# Altium project ThietbiTN.PrjPCB
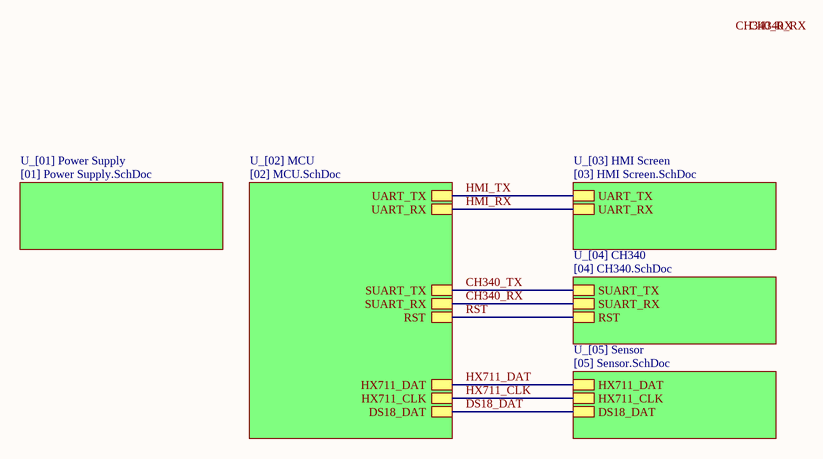
[diagram p0: ThietbiTN.SchDoc]
6 sheets, 60 parts. Net scope: hierarchical (ports join the sheet entries above them; power ports are global).
Board file: LoadCellV1_1.PcbDoc
Sheets:
  ThietbiTN.SchDoc
    U_[02] MCU = [02] MCU.SchDoc
    U_[01] Power Supply = [01] Power Supply.SchDoc
    U_[03] HMI Screen = [03] HMI Screen.SchDoc
    U_[04] CH340 = [04] CH340.SchDoc
    U_[05] Sensor = [05] Sensor.SchDoc

## Sheet ThietbiTN.SchDoc
size A4

### Sub-sheets
U_[01] Power Supply = [01] Power Supply.SchDoc: no entries
U_[02] MCU = [02] MCU.SchDoc: DS18_DAT, HX711_CLK, HX711_DAT, UART_TX, UART_RX, SUART_RX, SUART_TX, RST
U_[03] HMI Screen = [03] HMI Screen.SchDoc: UART_RX, UART_TX
U_[04] CH340 = [04] CH340.SchDoc: SUART_RX, SUART_TX, RST
U_[05] Sensor = [05] Sensor.SchDoc: HX711_DAT, HX711_CLK, DS18_DAT

### Nets
CH340_RX: sheet U_[02] MCU/SUART_RX, sheet U_[04] CH340/SUART_RX
CH340_TX: sheet U_[02] MCU/SUART_TX, sheet U_[04] CH340/SUART_TX
DS18_DAT: sheet U_[02] MCU/DS18_DAT, sheet U_[05] Sensor/DS18_DAT
HMI_RX: sheet U_[02] MCU/UART_RX, sheet U_[03] HMI Screen/UART_RX
HMI_TX: sheet U_[02] MCU/UART_TX, sheet U_[03] HMI Screen/UART_TX
HX711_CLK: sheet U_[02] MCU/HX711_CLK, sheet U_[05] Sensor/HX711_CLK
HX711_DAT: sheet U_[02] MCU/HX711_DAT, sheet U_[05] Sensor/HX711_DAT
RST: sheet U_[02] MCU/RST, sheet U_[04] CH340/RST  [project net RESET]

### Notes on the sheet
- Labels drawn without touching a wire or pin: CH340_RX

## Sheet [02] MCU.SchDoc
size A4
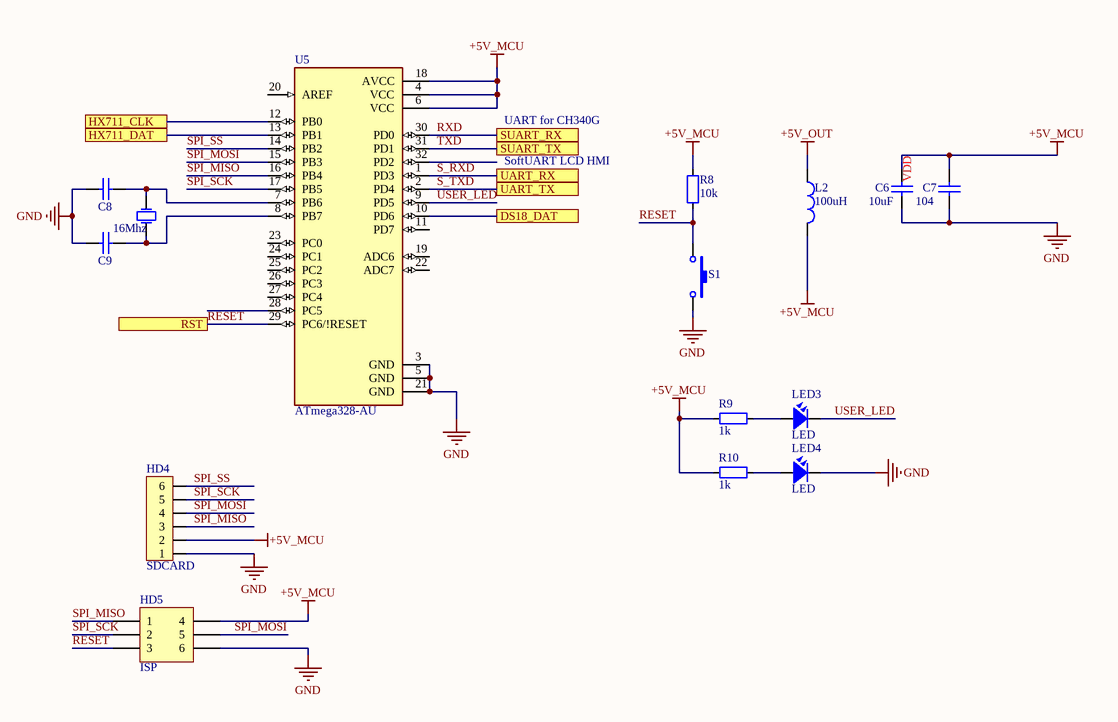
[diagram p1: [02] MCU.SchDoc]

### Parts
C6  10uF  [CAP_0805]
C7  104  [CAP_0805]
C8  Capacitor Ceramic  [CAP_0805]  (value not drawn)
C9  Capacitor Ceramic  [CAP_0805]  (value not drawn)
HD4  SDCARD  [CON_6P]
HD5  ISP  [HDR2X3_CEN]
L2  100uH  [RES-SMD-0805]
LED3  LED  [LED-0805-Red]
LED4  LED  [LED-0805-Red]
R8  10k  [RES-SMD-0805]
R9  1k  [RES-SMD-0805]
R10  1k  [RES-SMD-0805]
S1  SW-SMD  [SW-SMD]  (value not drawn)
U5  ATmega328-AU  [TQFP 32]
Y1  16Mhz  [XTAL]

### Ports
DS18_DAT, HX711_CLK, HX711_DAT, RST, SUART_RX, SUART_TX, UART_RX, UART_TX

### Nets
+5V_MCU: C6.2 C7.2 HD4.2 HD5.4 L2.2 R8.1 R9.1 R10.1 U5.4(VCC) U5.6(VCC) U5.18(AVCC)
+5V_OUT: L2.1
GND: C6.1 C7.1 C8.1 C9.1 HD4.1 HD5.6 LED4.2 S1.2 U5.3(GND) U5.5(GND) U5.21(GND)
DS18_DAT: U5.10(PD6) ; port DS18_DAT
HX711_CLK: U5.12(PB0) ; port HX711_CLK
HX711_DAT: U5.13(PB1) ; port HX711_DAT
RESET: HD5.3 R8.2 S1.1 U5.29(PC6/!RESET) ; port RST
RXD: U5.30(PD0) ; port SUART_RX  [project net CH340_RX]
S_RXD: U5.1(PD3) ; port UART_RX  [project net HMI_RX]
S_TXD: U5.2(PD4) ; port UART_TX  [project net HMI_TX]
SPI_MISO: HD4.3 HD5.1 U5.16(PB4)
SPI_MOSI: HD4.4 HD5.5 U5.15(PB3)
SPI_SCK: HD4.5 HD5.2 U5.17(PB5)
SPI_SS: HD4.6 U5.14(PB2)
TXD: U5.31(PD1) ; port SUART_TX  [project net CH340_TX]
USER_LED: LED3.2 U5.9(PD5)
NetC8_2: C8.2 U5.7(PB6) Y1.2(OSC2)
NetC9_2: C9.2 U5.8(PB7) Y1.1(OSC1)
NetLED3_1: LED3.1 R9.2
NetLED4_1: LED4.1 R10.2

Not connected (* = marked no-connect by the designer): U5 11(PD7) 19(ADC6) 20(AREF) 22(ADC7) 23(PC0) 24(PC1) 25(PC2) 26(PC3) 27(PC4) 28(PC5) 32(PD2)

### Notes on the sheet
- UART for CH340G
- SoftUART LCD HMI
- (near C6) VDD

### Library data of the parts
C6-C9 = CapSMD: Capacitor; Value: 33p; Published: 8-Jun-2000; LatestRevisionDate: 17-Jul-2002; LatestRevisionNote: Re-released for DXP Platform.; PackageReference: RAD-0.3; Publisher: Altium Limited
HD4 = Header6: Header IDC, 6 x 1 Pin Vertical 2.54mm Pitch (Non-Boxed, Male); Manufacturer: W¨¹rth Elektronik eiSos GmbH; partNo: 613002143121; ComponentLink1 Description: Manufacturer; ComponentLink2 Description: Datasheet; NoPins: 02; Created Date: 29 March 2013; ComponentLink1URL: http://www.we-online.com; ComponentLink2URL: http://katalog.we-online.de/em/datasheet/6130xx143121.pdf; Created by: Karrer Zheng
HD5 = Header 3X2A: Header, 3-Pin, Dual row; LatestRevisionDate: 17-Jul-2002; LatestRevisionNote: Re-released for DXP Platform.; Publisher: Altium Limited
L2 = Inductor: Value: 150 mH
LED3 LED4 = LED: LED Single colour Green and Red; Value: LED 3 ly Single Colour
R8-R10 = Resistor - SMD: Resistor; Manufacturer: Generic Components; Class: Passive; Published: 08/06/2000; Publisher: Altium Hobart Technology Centre
S1 = SW-SMD: Switch; Published: 24-Mar-1999; LatestRevisionDate: 17-Jul-2002; LatestRevisionNote: Re-released for DXP Platform.; PackageReference: SPST-2; Publisher: Altium Limited
U5 = ATmega328-AU: 8-bit AVR Microcontroller, 32KB Flash, 1KB EEPROM, 2KB SRAM, 32-pin TQFP, Industrial Grade (-40°C to 85°C); Published: 1-Apr-2010; DatasheetVersion: revA, Jan-2010; PackageVersion: revB, Oct-2001; PackageReference: 32A; Publisher: Altium Limited; PackageDescription: 32-Lead, 7x7x1.0 mm Body, 0.8mm Lead Pitch, Thin Profile Plastic Quad Flat Package (TQFP); Code_JEDEC: MS-026-ABA
Y1 = XTAL: Crystal Oscillator; Published: 8-Jun-2000; LatestRevisionDate: 17-Jul-2002; LatestRevisionNote: Re-released for DXP Platform.; PackageReference: R38; Publisher: Altium Limited

## Sheet [01] Power Supply.SchDoc
size A4
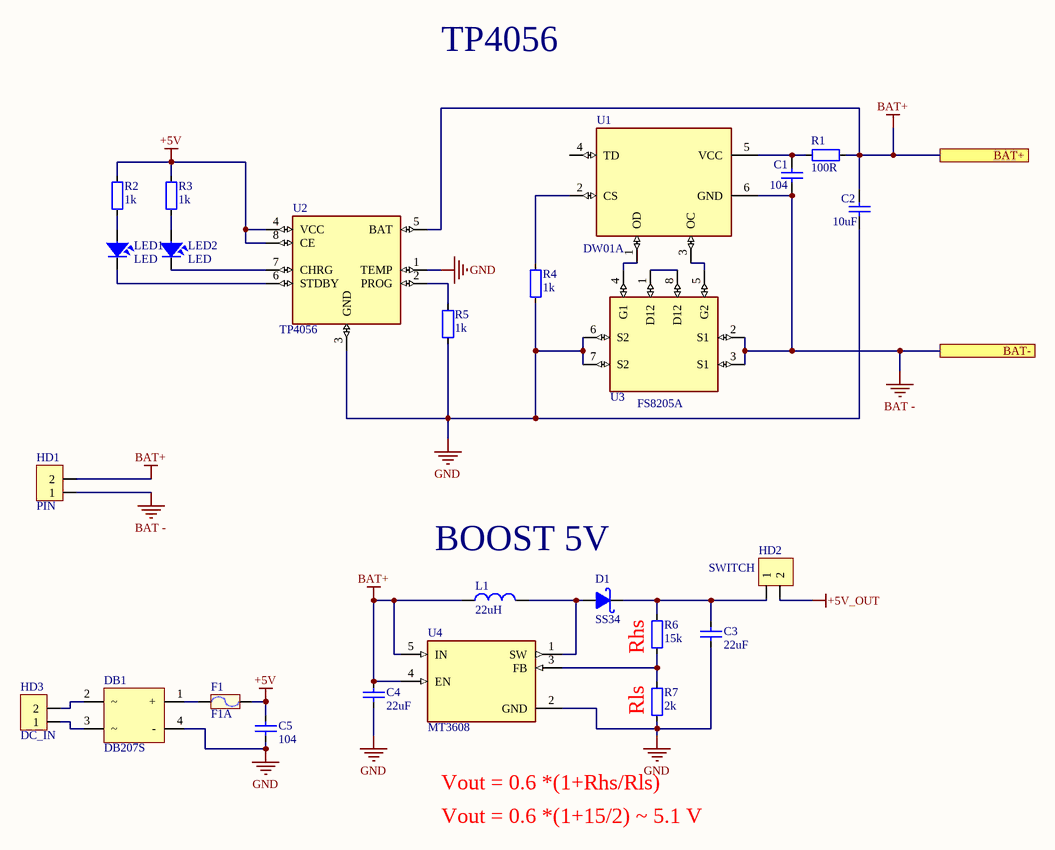
[diagram p2: [01] Power Supply.SchDoc]

### Parts
C1  104  [CAP_0805]
C2  10uF  [CAP_0805]
C3  22uF  [CAP_1206]
C4  22uF  [CAP_1206]
C5  104  [CAP_0805]
D1  SS34  [DO-214AA]
DB1  DB207S  [DB207S]
F1  F1A  [RES-SMD-1812]
HD1  PIN  [HED2T]
HD2  SWITCH  [HED2T]
HD3  DC_IN  [HED2T]
L1  22uH  [CD75-220]
LED1  LED  [LED-0805-Green]
LED2  LED  [LED-0805-Red]
R1  100R  [RES-SMD-0805]
R2  1k  [RES-SMD-0805]
R3  1k  [RES-SMD-0805]
R4  1k  [RES-SMD-0805]
R5  1k  [RES-SMD-0805]
R6  15k  [RES-SMD-0805]
R7  2k  [RES-SMD-0805]
U1  DW01A  [SOT23-6]
U2  TP4056  [TP4056]
U3  FS8205A  [FS8205A]
U4  MT3608  [MT3608]

### Ports
BAT+, BAT-

### Nets
+5V: C5.2 F1.2 R2.2 R3.2 U2.4(VCC) U2.8(CE)
+5V_OUT: HD2.2
BAT -: C1.1 HD1.1 U1.6(GND) U3.2(S1) U3.3(S1) ; port BAT-
BAT+: C2.2 C4.2 HD1.2 L1.1 R1.1 U2.5(BAT) U4.4(EN) U4.5(IN) ; port BAT+
GND: C2.1 C3.1 C4.1 C5.1 DB1.4(-) R4.1 R5.1 R7.1 U2.1(TEMP) U2.3(GND) U3.6(S2) U3.7(S2) U4.2(GND)
NetC1_2: C1.2 R1.2 U1.5(VCC)
NetC3_2: C3.2 D1.2(K) HD2.1 R6.2
NetD1_1: D1.1(A) L1.2 U4.1(SW)
NetDB1_1: DB1.1(+) F1.1
NetDB1_2: DB1.2 HD3.2
NetDB1_3: DB1.3 HD3.1
NetLED1_1: LED1.1 R2.1
NetLED1_2: LED1.2 U2.6(STDBY)
NetLED2_1: LED2.1 R3.1
NetLED2_2: LED2.2 U2.7(CHRG)
NetR4_2: R4.2 U1.2(CS)
NetR5_2: R5.2 U2.2(PROG)
NetR6_1: R6.1 R7.2 U4.3(FB)
NetU1_1: U1.1(OD) U3.4(G1)
NetU1_3: U1.3(OC) U3.5(G2)
NetU3_1: U3.1(D12) U3.8(D12)

Not connected (* = marked no-connect by the designer): U1 4(TD)

### Notes on the sheet
- TP4056
- BOOST 5V
- (near R6) Rhs
- (near R7) Rls
- Vout = 0.6 *(1+Rhs/Rls)
- Vout = 0.6 *(1+15/2) ~ 5.1 V

### Library data of the parts
C1-C5 = CapSMD: Capacitor; Value: 33p; Published: 8-Jun-2000; LatestRevisionDate: 17-Jul-2002; LatestRevisionNote: Re-released for DXP Platform.; PackageReference: RAD-0.3; Publisher: Altium Limited
D1 = 1N5822: Schottky Rectifiers; Value: Diode c?m 1N5408
DB1 = Diode Bridge Flate: Diode Bridge
F1 = Fuse: Designed by: VanDungEvn; Value: Fuse
HD1-HD3 = Header2: Header IDC, 2 x 1 Pin Vertical 2.54mm Pitch (Non-Boxed, Male); Manufacturer: W¨¹rth Elektronik eiSos GmbH; partNo: 613002143121; ComponentLink1 Description: Manufacturer; ComponentLink2 Description: Datasheet; NoPins: 02; Created Date: 29 March 2013; ComponentLink1URL: http://www.we-online.com; ComponentLink2URL: http://katalog.we-online.de/em/datasheet/6130xx143121.pdf; Created by: Karrer Zheng
L1 = Inductor: Inductor 22uH CD75; Value: 150 mH
LED1 LED2 = LED: as LED3 on sheet [02] MCU
R1-R7 = Resistor - SMD: as R8 on sheet [02] MCU; Published: 08/06/2000; Publisher: Altium Hobart Technology Centre
U1 = DW01A: One Cell Lithium-ion/Polymer Battery Protection IC
U2 = TP4056: Complete single cell Li-Ion battery with a constant current / constant voltage linear charger
U4 = MT3608: High Efficiency 1.2MHz 2A Step Up Converter

## Sheet [03] HMI Screen.SchDoc
size A4
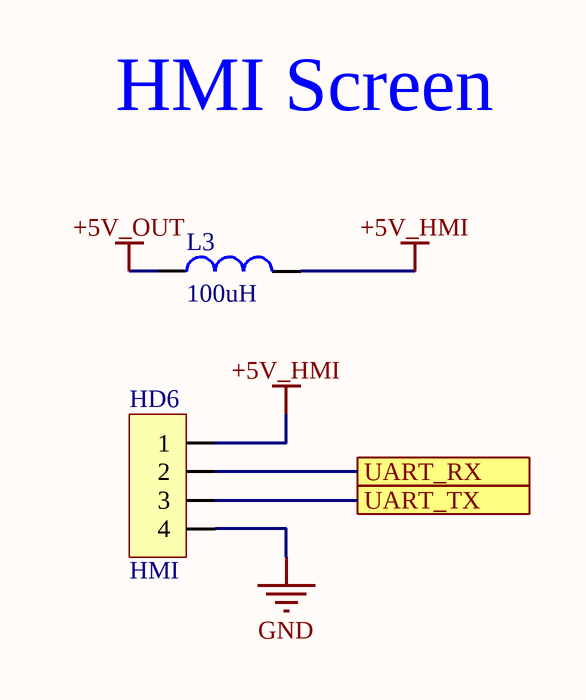
[diagram p3: [03] HMI Screen.SchDoc]

### Parts
HD6  HMI  [CON_4P]
L3  100uH  [RES-SMD-0805]

### Ports
UART_RX, UART_TX

### Nets
+5V_HMI: HD6.1 L3.2
+5V_OUT: L3.1
GND: HD6.4
HMI_RX: HD6.2 ; port UART_RX
HMI_TX: HD6.3 ; port UART_TX

### Notes on the sheet
- HMI Screen

### Library data of the parts
HD6 = JP4: Manufacturer: W¨¹rth Elektronik eiSos GmbH; partNo: 613004143121; ComponentLink1 Description: Manufacturer; ComponentLink2 Description: Datasheet; NoPins: 04; Created Date: 29 March 2013; ComponentLink1URL: http://www.we-online.com; ComponentLink2URL: http://katalog.we-online.de/em/datasheet/6130xx143121.pdf; Created by: Karrer Zheng
L3 = Inductor: Value: 150 mH

## Sheet [04] CH340.SchDoc
size A4
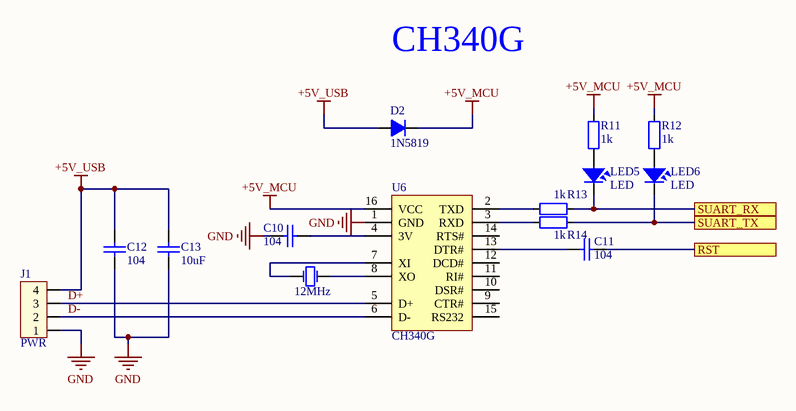
[diagram p4: [04] CH340.SchDoc]

### Parts
C10  104  [CAP_0805]
C11  104  [CAP_0805]
C12  104  [CAP_0805]
C13  10uF  [CAP_0805]
D2  1N5819  [DO-214AB SMA]
J1  PWR  [HED4B]
LED5  LED  [LED-0805-Green]
LED6  LED  [LED-0805-Green]
R11  1k  [RES-SMD-0805]
R12  1k  [RES-SMD-0805]
R13  1k  [RES-SMD-0805]
R14  1k  [RES-SMD-0805]
U6  CH340G  [SO16]
Y2  12MHz  [XTAL 5032 SMD]

### Ports
RST, SUART_RX, SUART_TX

### Nets
+5V_MCU: D2.2(K) R11.2 R12.2 U6.16(VCC)
+5V_USB: C12.2 C13.2 D2.1(A) J1.4
GND: C10.1 C12.1 C13.1 J1.1 U6.1(GND)
CH340_RX: LED5.2 R13.2 ; port SUART_RX
CH340_TX: LED6.2 R14.2 ; port SUART_TX
D+: J1.3 U6.5(D+)
D-: J1.2 U6.6(D-)
RESET: C11.2 ; port RST
NetC10_2: C10.2 U6.4(3V)
NetC11_1: C11.1 U6.13(DTR#)
NetLED5_1: LED5.1 R11.1
NetLED6_1: LED6.1 R12.1
NetR13_1: R13.1 U6.2(TXD)
NetR14_1: R14.1 U6.3(RXD)
NetU6_7: U6.7(XI) Y2.1(OSC1)
NetU6_8: U6.8(XO) Y2.2(OSC2)

Not connected (* = marked no-connect by the designer): U6 9(CTR#) 10(DSR#) 11(RI#) 12(DCD#) 14(RTS#) 15(RS232)

### Notes on the sheet
- CH340G

### Library data of the parts
C10-C13 = CapSMD: Capacitor; Value: 33p; Published: 8-Jun-2000; LatestRevisionDate: 17-Jul-2002; LatestRevisionNote: Re-released for DXP Platform.; PackageReference: RAD-0.3; Publisher: Altium Limited
D2 = D1A_1: Diode 1A; Value: 1N4007
J1 = Hed4: Header 4 (Green); Value: Header 4
LED5 LED6 = LED: as LED3 on sheet [02] MCU
R11-R14 = Resistor - SMD: as R8 on sheet [02] MCU; Published: 08/06/2000; Publisher: Altium Hobart Technology Centre
U6 = CH340G: High and Low Side Driver; Note: Pins 4, 8 and 14 are not connected; Published: 8-Jun-2000; LatestRevisionDate: 04-Mar-2005; LatestRevisionNote: Stylized 3D Model Added.; DatasheetVersion: PD60147J; PackageReference: PDIP14; Publisher: Altium Limited; PackageDescription: DIP; 14 Leads; Row Spacing 7.62 mm; Pitch 2.54 mm; ComponentLink1Description: Manufacturer Link; ComponentLink1URL: http://www.irf.com/; ComponentLink2Description: Datasheet; ComponentLink2URL: http://www.irf.com/product-info/datasheets/data/ir2110.pdf
Y2 = XTAL: Crystal Oscillator; Published: 8-Jun-2000; LatestRevisionDate: 17-Jul-2002; LatestRevisionNote: Re-released for DXP Platform.; PackageReference: R38; Publisher: Altium Limited

## Sheet [05] Sensor.SchDoc
size A4
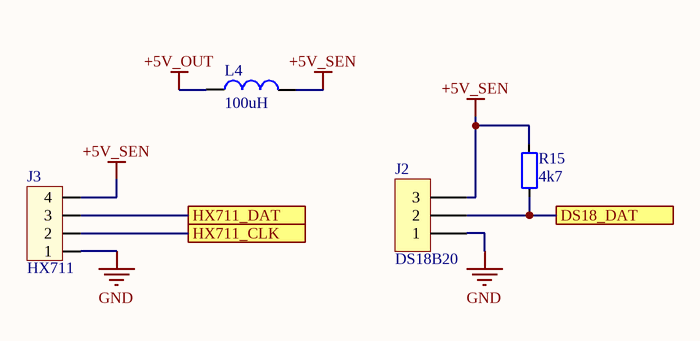
[diagram p5: [05] Sensor.SchDoc]

### Parts
J2  DS18B20  [HED 3P 15EDG3.81]
J3  HX711  [HED4B]
L4  100uH  [RES-SMD-0805]
R15  4k7  [RES-SMD-0805]

### Ports
DS18_DAT, HX711_CLK, HX711_DAT

### Nets
+5V_OUT: L4.1
+5V_SEN: J2.3 J3.4 L4.2 R15.2
GND: J2.1 J3.1
DS18_DAT: J2.2 R15.1 ; port DS18_DAT
HX711_CLK: J3.2 ; port HX711_CLK
HX711_DAT: J3.3 ; port HX711_DAT

### Library data of the parts
J2 = KF3: Manufacturer: Würth Elektronik eiSos GmbH; partNo: 691103110003; ComponentLink1 Description: Manufacturer; ComponentLink2 Description: Datasheet; NoPins: 3; Created Date: 29 October 2013; ComponentLink1URL: http://www.we-online.com; ComponentLink2URL: http://katalog.we-online.de/em/datasheet/6911031100xx.pdf; Created by: Karrer Zheng
J3 = Hed4: Header 4 (Green); Value: Header 4
L4 = Inductor: Value: 150 mH
R15 = Resistor - SMD: as R8 on sheet [02] MCU; Published: 08/06/2000; Publisher: Altium Hobart Technology Centre

## Nets that join several sheets
+5V_MCU: [02] MCU (11 pins), [04] CH340 (D2.2 R11.2 R12.2 U6.16)
+5V_OUT: [02] MCU (L2.1), [01] Power Supply (HD2.2), [03] HMI Screen (L3.1), [05] Sensor (L4.1)
GND: [02] MCU (11 pins), [01] Power Supply (13 pins), [03] HMI Screen (HD6.4), [04] CH340 (5 pins), [05] Sensor (J2.1 J3.1)
CH340_RX: [02] MCU (U5.30), [04] CH340 (LED5.2 R13.2)
CH340_TX: [02] MCU (U5.31), [04] CH340 (LED6.2 R14.2)
DS18_DAT: [02] MCU (U5.10), [05] Sensor (J2.2 R15.1)
HMI_RX: [02] MCU (U5.1), [03] HMI Screen (HD6.2)
HMI_TX: [02] MCU (U5.2), [03] HMI Screen (HD6.3)
HX711_CLK: [02] MCU (U5.12), [05] Sensor (J3.2)
HX711_DAT: [02] MCU (U5.13), [05] Sensor (J3.3)
RESET: [02] MCU (HD5.3 R8.2 S1.1 U5.29), [04] CH340 (C11.2)